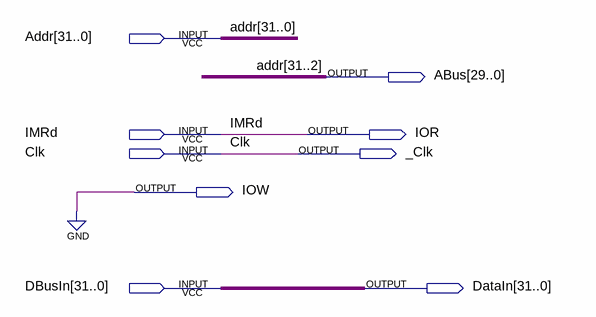
[diagram p0: schematic sheet]
// Quartus schematic IBIU.bdf as structural Verilog: 0 symbols, 9 pins
module IBIU (
  input  [31:0] Addr,
  input  IMRd,
  input  Clk,
  input  [31:0] DBusIn,
  output [29:0] ABus,
  output IOR,
  output _Clk,
  output IOW,
  output [31:0] DataIn
);


  assign _Clk = Clk;
  assign ABus = Addr[31:2];
  assign DataIn = DBusIn;
  assign IOR = IMRd;
  assign IOW = 1'b0;
endmodule
